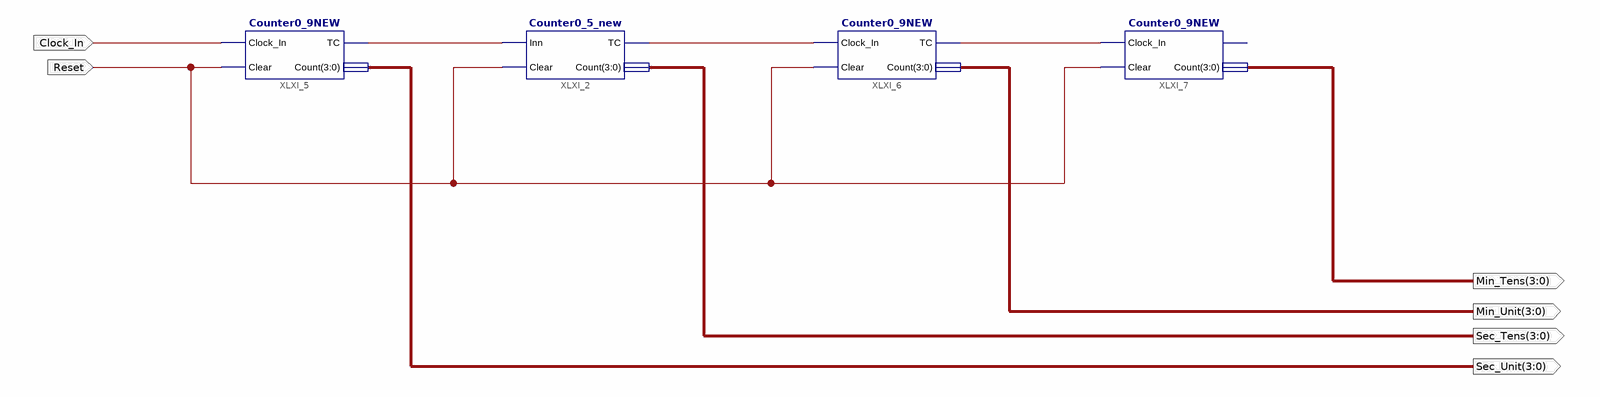
[diagram p0: schematic sheet 1]
// Xilinx ISE schematic ClockMM_SS_NEW.sch (spartan6) as structural Verilog: 4 symbols, 6 ports
module ClockMM_SS_NEW (
  input  Clock_In,
  input  Reset,
  output [3:0] Sec_Unit,
  output [3:0] Sec_Tens,
  output [3:0] Min_Unit,
  output [3:0] Min_Tens
);

  wire XLXN_3, XLXN_4, XLXN_6;

  Counter0_5_new XLXI_2 (.Inn(XLXN_3), .Clear(Reset), .TC(XLXN_4), .Count(Sec_Tens));
  Counter0_9NEW XLXI_5 (.Clock_In(Clock_In), .Clear(Reset), .TC(XLXN_3), .Count(Sec_Unit));
  Counter0_9NEW XLXI_6 (.Clock_In(XLXN_4), .Clear(Reset), .TC(XLXN_6), .Count(Min_Unit));
  Counter0_9NEW XLXI_7 (.Clock_In(XLXN_6), .Clear(Reset), .Count(Min_Tens));  // open: TC
endmodule
